# Altium schematic sheet LCL_FIlter.SchDoc
size Letter; SheetNumber: 1; SheetTotal: 1
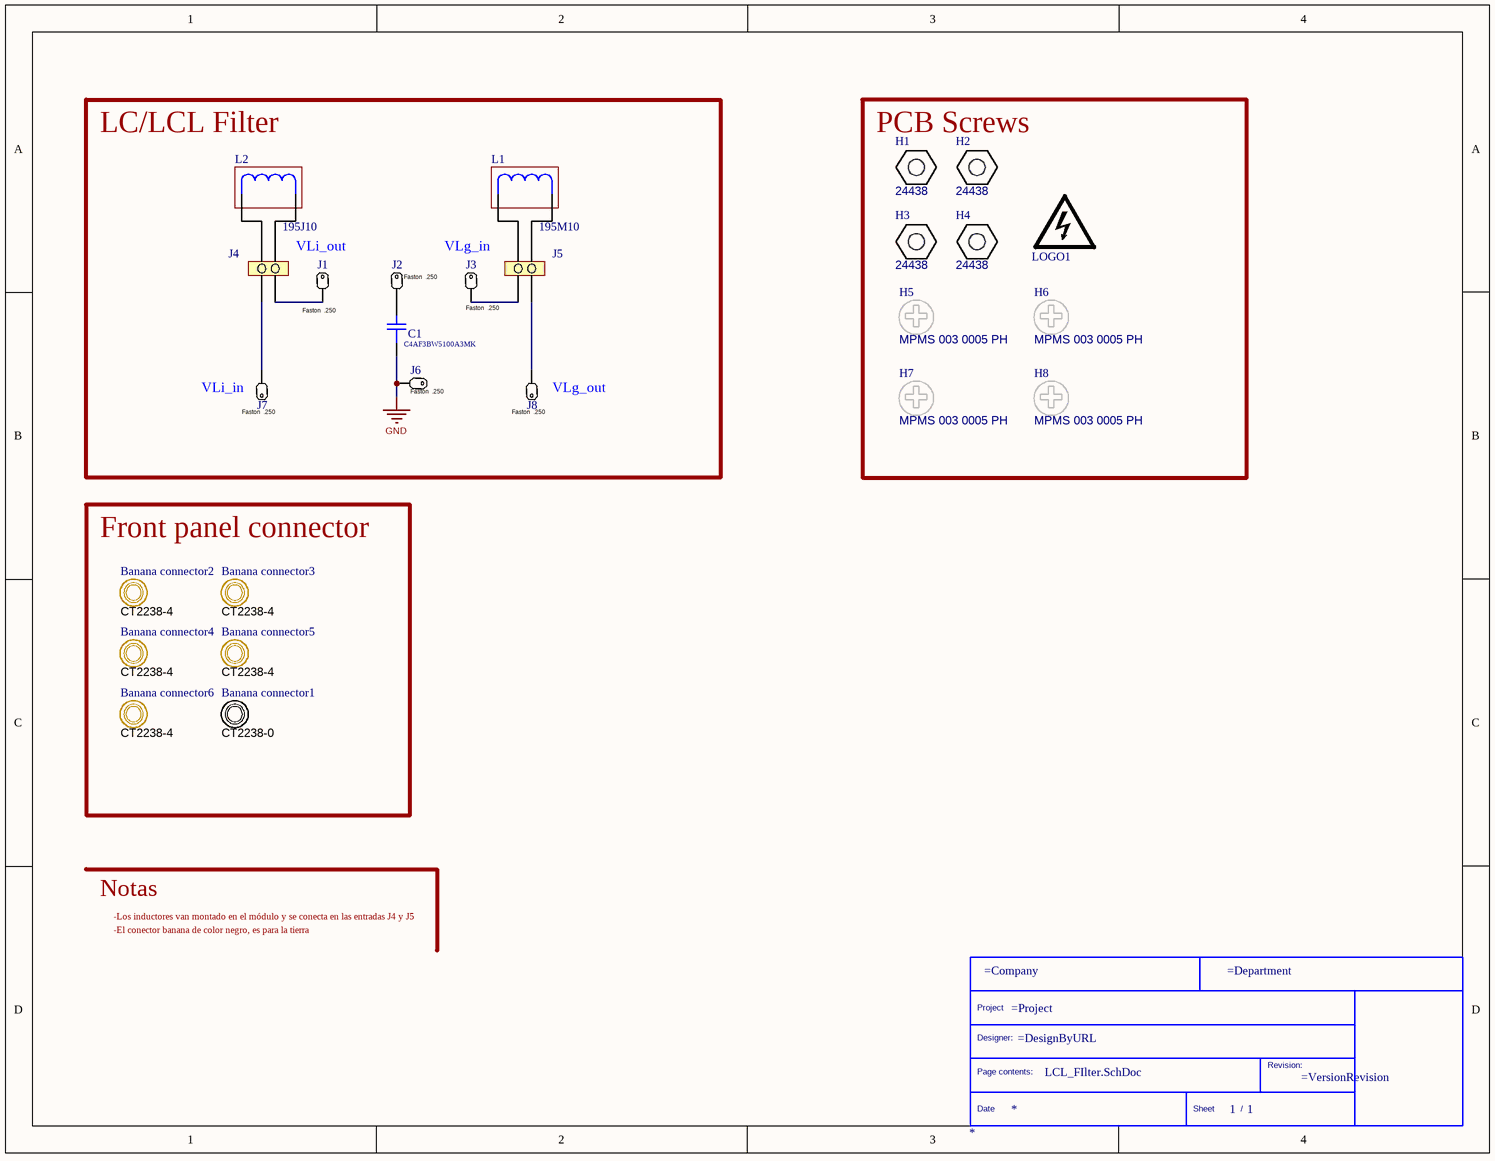
[diagram p0: LCL_FIlter.SchDoc]

## Parts
*  TittleBlock  (value not drawn)  (graphical)
Banana_connector1  CT2238-0  (mechanical)
Banana_connector2  CT2238-4  (mechanical)
Banana_connector3  CT2238-4  (mechanical)
Banana_connector4  CT2238-4  (mechanical)
Banana_connector5  CT2238-4  (mechanical)
Banana_connector6  CT2238-4  (mechanical)
C1  C4AF3BW5100A3MK  [C4AF Capacitors]
H1  24438  [Keystone24438]
H2  24438  [Keystone24438]
H3  24438  [Keystone24438]
H4  24438  [Keystone24438]
H5  MPMS 003 0005 PH  [BuildingFastener_MPMS_003_0005_PH]
H6  MPMS 003 0005 PH  [BuildingFastener_MPMS_003_0005_PH]
H7  MPMS 003 0005 PH  [BuildingFastener_MPMS_003_0005_PH]
H8  MPMS 003 0005 PH  [BuildingFastener_MPMS_003_0005_PH]
J1  Faston  .250  [TE_62409-1]
J2  Faston  .250  [TE_62409-1]
J3  Faston  .250  [TE_62409-1]
J4  2P Terminal,  12-20  AWG  [TE_8PCV-02-006]  (value not drawn)
J5  2P Terminal,  12-20  AWG  [TE_8PCV-02-006]  (value not drawn)
J6  Faston  .250  [TE_62409-1]
J7  Faston  .250  [TE_62409-1]
J8  Faston  .250  [TE_62409-1]
L1  195M10
L2  195J10  (mechanical)
LOGO1  DANGER HIGH VOLTAGE  [IEC_HighVoltage_Medium]  (value not drawn)  (no BOM)

## Blocks framed on the sheet
LC/LCL Filter: C1 J1-J8 L1 L2
PCB Screws: H1-H8 LOGO1
Front panel connector: Banana_connector1-Banana_connector6

## Nets
GND: C1.2 J6.1(P1)
NetC1_1: C1.1 J2.1(P1)
NetJ1_1: J1.1(P1) J4.1
NetJ3_1: J3.1(P1) J5.2
NetJ4_2: J4.2 J7.1(P1)
NetJ5_1: J5.1 J8.1(P1)

## Notes on the sheet
- VLi_out
- VLg_in
- (near J7) VLi_in
- (near J8) VLg_out
- Notas
- -Los inductores van montado en el módulo y se conecta en las entradas J4 y J5
- -El conector banana de color negro, es para la tierra
- (in symbol TittleBlock) Project; Designer:; Page contents:; Revision:; Date; Sheet; /

## Library data of the parts
* = TittleBlock: Standard Title block
Banana_connector1 = CT2238-0: Cable Assembly 4MM Safety Jack, Panel W/.25 Fast on Terminal Black; Manufacturer: Cal Test Electronics; Supplier 1: Digi-Key; Supplier Part Number 1: BKCT2238-0-ND; Manufacturer Part Number: CT2238-0; RoHS: No; Stock 1: 1448; Pricing 1: 1=2,00000 (USD)
Banana_connector2-Banana_connector6 = CT2238-4: Cable Assembly 4MM Safety Jack, Panel W/.25 Fast on Terminal Yellow; Manufacturer: Cal Test Electronics; Manufacturer Part Number: CT2238-0; Supplier 1: Digi-Key; Supplier Part Number 1: BKCT2238-0-ND; RoHS: No; Stock 1: 1448; Pricing 1: 1=2,00000 (USD)
C1 = C4AF3BW5100A3MK: Cap Film 10uF 800V PP 10% (57.5 X 30 X 45mm) Radial 52.5mm 105°C Bulk; Manufacturer: KEMET; Supplier 1: Digi-Key; Supplier Part Number 1: 399-17837-ND; Manufacturer Part Number: C4AF3BW5100A3MK; RoHS: Yes; Category: Film Capacitors; Stock 1: 162; Pricing 1: 1=9,21000, 10=8,18900, 50=7,16540, 100=6,55120, 500=5,73230 (USD); RoHS Compliant: Yes
H1-H4 = CMP-0003640-1: Standoff, Hex,25mm Length, M3, Aluminum; Manufacturer: Keystone; CompType: Hardware; ComponentLink1URL: http://www.keyelco.com/userAssets/file/M60-2p72.pdf; Key: 24438; Publisher: Texas Instruments; Supplier Part Number 2: 534-24438; Supplier 1: Digi-Key; PackageReference: Standoff M3; LatestRevisionDate: 2017-03-09; RoHS: Y; Supplier Part Number 1: 36-24438-ND; MountType: TH; Supplier 2: Mouser; PartNumber: 24438; ComponentLink1Description: Datasheet Link
H5-H8 = CMP-0003646-1: MACHINE SCREW PAN PHILLIPS M3 5mm; Manufacturer: B&F Fastener Supply; CompType: Hardware; ComponentLink1URL: http://www.fasnetdirect.com/refguide/MetD7985a.pdf; Key: MPMS 003 0005 PH; Publisher: Texas Instruments; PackageReference: Screw M3 Phillips head; LatestRevisionDate: 2017-03-09; ClassName: Screw; RoHS: Y; MountType: N/A; PartNumber: MPMS 003 0005 PH; ComponentLink1Description: Datasheet Link; Supplier 1: Digi-Key; Supplier Part Number 1: H742-ND
J1-J3 J6-J8 = 62409-1: Quick Disconnect Terminal M 15.8mm 7.5mm Tin Over Copper Automotive Bag; Manufacturer: AMP - TE CONNECTIVITY; Manufacturer Part Number: 62409-1; RoHS: No; Stock 1: 8729; Pricing 1: 1=0,19000, 10=0,17800, 25=0,15200, 50=0,13320, 100=0,12360, 250=0,10936, 750=0,09035, 1500=0,08083, 8000=0,06895 (USD); ComponentLink1URL: http://www.farnell.com/datasheets/1650963.pdf?src-supplier=Farnell; ComponentLink1Description: http://www.farnell.com/datasheets/1650963.pdf?src-supplier=Farnell; ComponentLink2URL: http://www.farnell.com/datasheets/1650963.pdf?src-supplier=Element14; ComponentLink2Description: http://www.farnell.com/datasheets/1650963.pdf?src-supplier=Element14; ComponentLink3URL: http://www.farnell.com/datasheets/1650963.pdf?src-supplier=Newark; ComponentLink3Description: http://www.farnell.com/datasheets/1650963.pdf?src-supplier=Newark; ComponentLink4URL: https://www.te.com/commerce/DocumentDelivery/DDEController?Action=srchrtrv&DocNm=62409&DocType=Customer+Drawing&DocLang=English&src-supplier=Digi-Key; ComponentLink4Description: https://www.te.com/commerce/DocumentDelivery/DDEController?Action=srchrtrv&DocNm=62409&DocType=Customer+Drawing&DocLang=English&src-supplier=Digi-Key; Supplier 1: Newark; Supplier Part Number 1: 26AC8417
J4 J5 = 8PCV-02-006: Barrier Terminal Blocks VERTICAL RAISED 2P; Manufacturer: TE Connectivity; Max Voltage Rating (AC): 600V; Current Rating: 30A; Number of Contacts: 2; Mounting Ears: No (Without); Number of Levels: 1; Wire Gauge (Max): 18AWG; Wire Gauge (Min): 10AWG; Pitch: 11.1mm; Thread Size: M4; Supplier 1: Digi-Key; Supplier Part Number 1: A98460-ND; Manufacturer Part Number: 8PCV-02-006; RoHS: Yes; Category: Terminal Blocks; Stock 1: 4811; Pricing 1: 1=1,84000, 10=1,29200, 25=1,20480, 50=1,09360, 100=1,08880, 250=0,91940, 500=0,87102, 1000=0,77424, 5000=0,62907 (USD); Mount: Through Hole; Contact Material: Copper Alloy; Contact Plating: Tin; Color: Black; Housing Material: Thermoplastic; Terminal Material: Copper Alloy; Insulation Material: Thermoplastic; Material: Thermoplastic; Min Operating Temperature: -40°C; Max Operating Temperature: 248°C; Number of Rows: 1; Voltage Rating: 600V; Package Quantity: 270; Termination: Screw; Number of Circuits: 2; Orientation: Straight; Number of Wire Entries: 2; Number of Positions: 2; Max Current Rating: 30A; Mounting Insert: No (Without); Voltage: 600V; Series: #8, Buchanan; Length: 24.07mm; Width: 0.8inch; Height: 0.77inch; Depth: 0.77inch; Wire/Cable Gauge: 10AWG; Flammability Rating: UL94 V-0; ELV: Compliant; RoHS Compliant: Yes; ComponentLink1URL: https://datasheet.ciiva.com/30214/8pcv02006-30214903.pdf?src-supplier=Onlinecomponents.com; ComponentLink1Description: https://datasheet.ciiva.com/30214/8pcv02006-30214903.pdf?src-supplier=Onlinecomponents.com; ComponentLink2URL: https://datasheet.ciiva.com/11746/0900766b80fa362c-11746107.pdf?src-supplier=RSComponents; ComponentLink2Description: https://datasheet.ciiva.com/11746/0900766b80fa362c-11746107.pdf?src-supplier=RSComponents; ComponentLink3URL: https://datasheet.ciiva.com/5181/eng-cd-6-1437657-3-k4-5181165.pdf?src-supplier=Mouser; ComponentLink3Description: https://datasheet.ciiva.com/5181/eng-cd-6-1437657-3-k4-5181165.pdf?src-supplier=Mouser
L1 = 195M10: Fixed Inductors CHOKE; Manufacturer: Hammond Manufacturing; Current Rating: 10A; Tolerance: 15%; Shielding: Unshielded; Inductance: 20mH; DC Resistance (DCR): 13mR; Supplier 1: Digi-Key; Supplier Part Number 1: HM2136-ND; Manufacturer Part Number: 195M10; RoHS: Yes; Category: Fixed Inductors; Stock 1: 20; Pricing 1: 1=82,90000 (USD); Mount: Chassis Mount; Case/Package: 120; Weight: 10.2lb; Package Quantity: 1; Packaging: Bulk; Max DC Current: 10A; Termination: Screw; Series: 195; Length: 4.5inch; Width: 4.75inch; Height: 3.75inch; RoHS Compliant: Yes; ComponentLink1URL: http://www.mouser.com/ds/2/177/195-196-980958.pdf?src-supplier=Mouser; ComponentLink1Description: http://www.mouser.com/ds/2/177/195-196-980958.pdf?src-supplier=Mouser; ComponentLink2URL: https://www.alliedelec.com/m/d/8463d4499fe931fd0b51c89e75ad4eff.pdf?src-supplier=Allied+Electronics; ComponentLink2Description: https://www.alliedelec.com/m/d/8463d4499fe931fd0b51c89e75ad4eff.pdf?src-supplier=Allied+Electronics; ComponentLink3URL: https://www.hammfg.com/electronics/transformers/choke/195-196.pdf?src-supplier=Digi-Key; ComponentLink3Description: https://www.hammfg.com/electronics/transformers/choke/195-196.pdf?src-supplier=Digi-Key
L2 = 195J10: Fixed Inductors CHOKE; Manufacturer: Hammond Manufacturing; Shielding: Unshielded; Tolerance: 15%; Current Rating: 10A; Inductance: 10mH; DC Resistance (DCR): 70mR; Supplier 1: Digi-Key; Supplier Part Number 1: HM2135-ND; Manufacturer Part Number: 195J10; RoHS: Yes; Category: Fixed Inductors; Stock 1: 6; Pricing 1: 1=68,56000, 10=65,13000 (USD); Mount: Chassis Mount; Case/Package: Nonstandard; Weight: 6.5lb; Package Quantity: 1; Packaging: Bulk; Max DC Current: 10A; Termination: Screw; Series: 195; Length: 3.75inch; Width: 4.35inch; Height: 3.13inch; Height - Seated (Max): 3.13inch; Lead Free: Lead Free; RoHS Compliant: Yes; ComponentLink1URL: https://www.alliedelec.com/m/d/8463d4499fe931fd0b51c89e75ad4eff.pdf?src-supplier=Allied+Electronics; ComponentLink1Description: https://www.alliedelec.com/m/d/8463d4499fe931fd0b51c89e75ad4eff.pdf?src-supplier=Allied+Electronics; ComponentLink2URL: http://www.mouser.com/ds/2/177/5c0034-44711.pdf?src-supplier=Mouser; ComponentLink2Description: http://www.mouser.com/ds/2/177/5c0034-44711.pdf?src-supplier=Mouser; ComponentLink3URL: https://www.hammfg.com/electronics/transformers/choke/195-196.pdf?src-supplier=Digi-Key; ComponentLink3Description: https://www.hammfg.com/electronics/transformers/choke/195-196.pdf?src-supplier=Digi-Key
LOGO1 = CMP-0074835-1: IEC 61010-1 High Voltage Warning; SymbolCreator: a0412235; Lib Reference: IEC_HighVoltage; SymbolVersion: 2011-08-22; Published: 2009-03-03; Publisher: Texas Instruments; LatestRevisionDate: 2017-07-06; PartNumber: DANGER HIGH VOLTAGE; Library Reference: IEC_HighVoltage